# EAGLE design powerBoard_v2 (EAGLE 6.6.0)
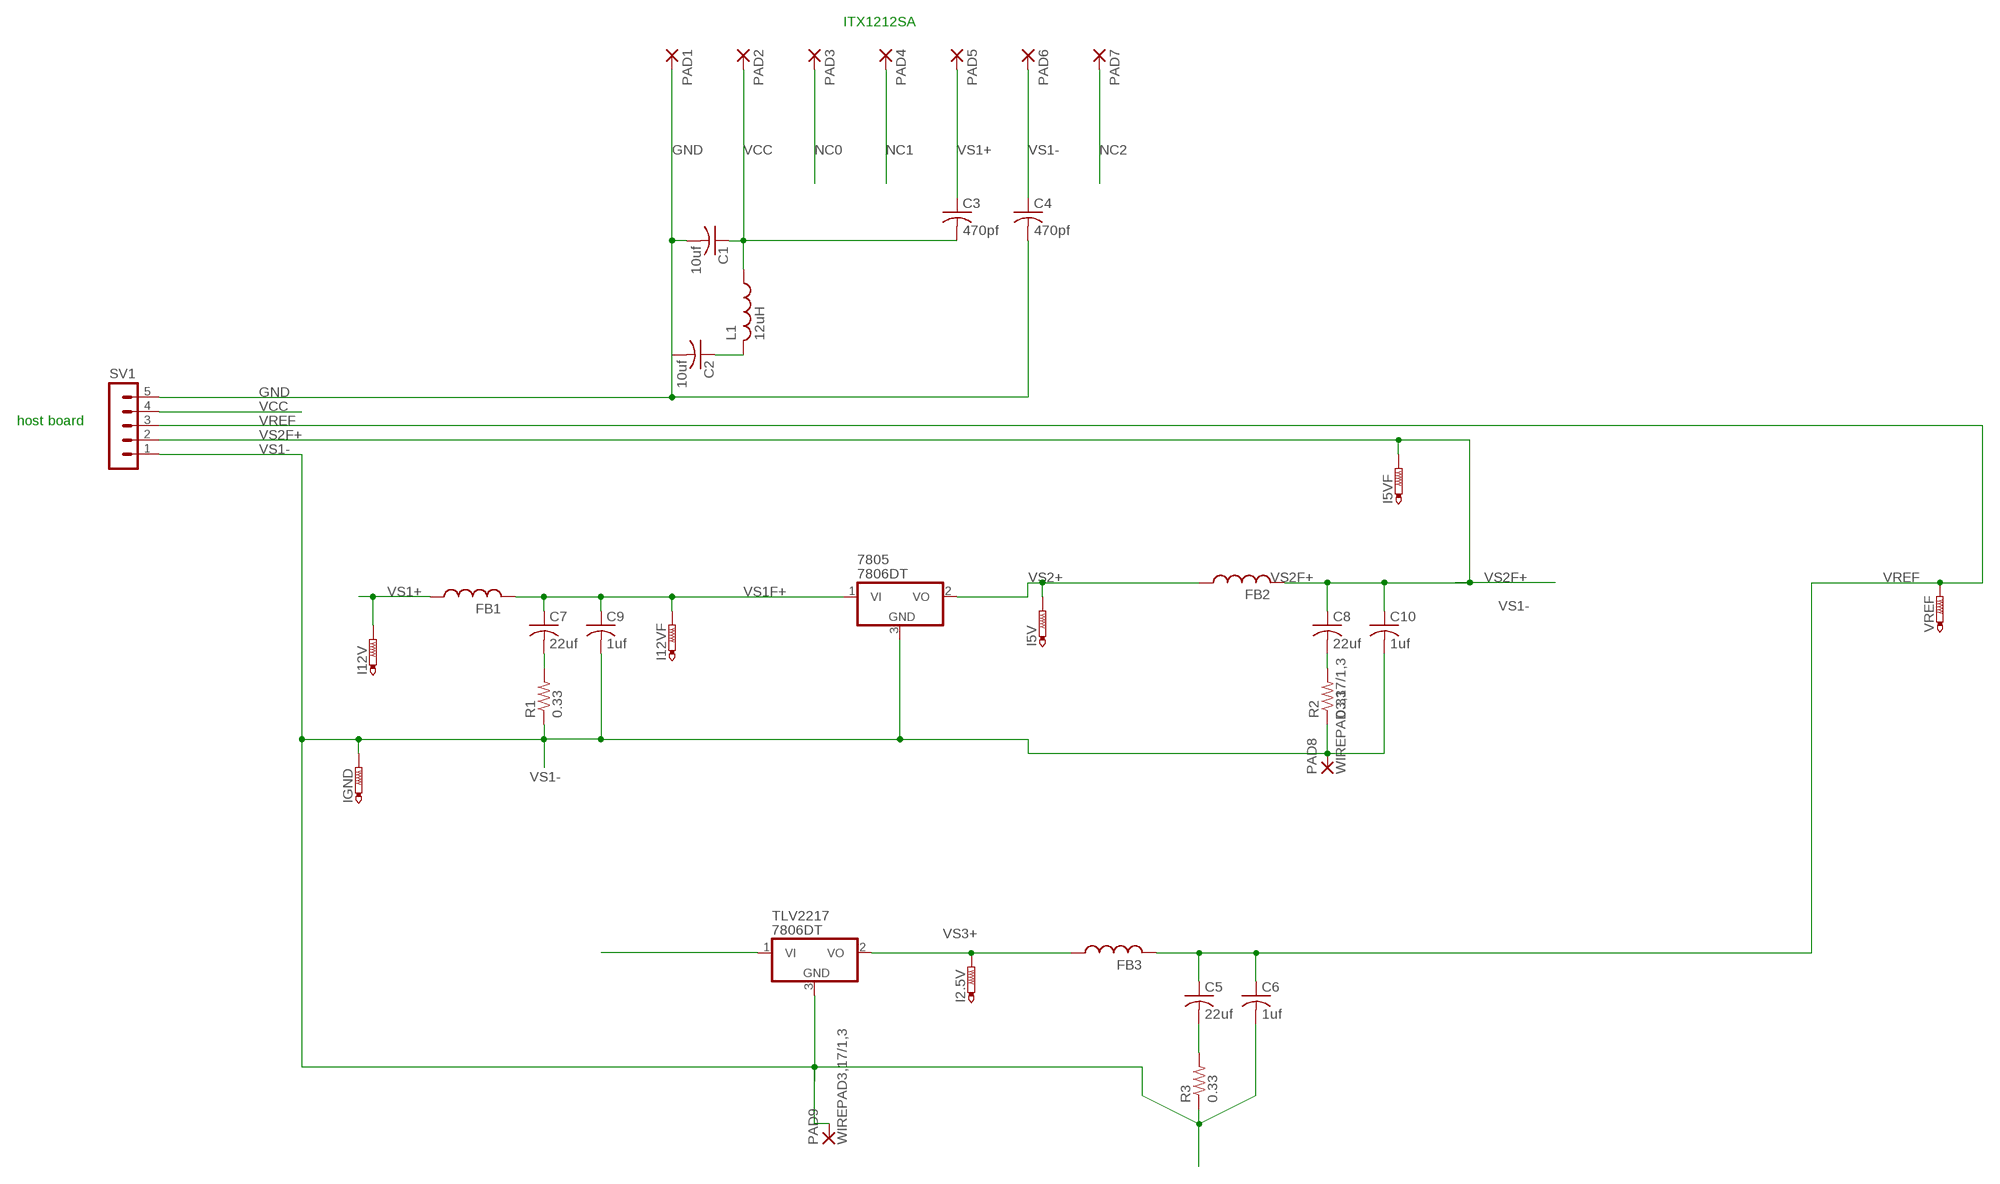
[diagram p0: schematic, sheet 1]

## Parts
7805  7806DT  [TO252]
C1  10uf  C-USC0805K  [C0805K]
C2  10uf  C-USC0805K  [C0805K]
C3  470pf  C-USC0805K  [C0805K]
C4  470pf  C-USC0805K  [C0805K]
C5  22uf  C-USC0805K  [C0805K]
C6  1uf  C-USC0805K  [C0805K]
C7  22uf  C-USC0805K  [C0805K]
C8  22uf  C-USC0805K  [C0805K]
C9  1uf  C-USC0805K  [C0805K]
C10  1uf  C-USC0805K  [C0805K]
FB1  L-USL2012C  [L2012C]
FB2  L-USL2012C  [L2012C]
FB3  L-USL2012C  [L2012C]
I2.5V  PTR1PAD1-13  [P1-13]
I5V  PTR1PAD1-13  [P1-13]
I5VF  PTR1PAD1-13  [P1-13]
I12V  PTR1PAD1-13  [P1-13]
I12VF  PTR1PAD1-13  [P1-13]
IGND  PTR1PAD1-13  [P1-13]
L1  12uH  L-USL2012C  [L2012C]
PAD1  SMD2  [SMD1,27-2,54]
PAD2  SMD2  [SMD1,27-2,54]
PAD3  SMD2  [SMD1,27-2,54]
PAD4  SMD2  [SMD1,27-2,54]
PAD5  SMD2  [SMD1,27-2,54]
PAD6  SMD2  [SMD1,27-2,54]
PAD7  SMD2  [SMD1,27-2,54]
PAD8  WIREPAD3,17/1,3  [3,17/1,3]
PAD9  WIREPAD3,17/1,3  [3,17/1,3]
R1  0.33  R-US_R2012W  [R2012W]
R2  0.33  R-US_R2012W  [R2012W]
R3  0.33  R-US_R2012W  [R2012W]
SV1  MA05-1  [MA05-1]
TLV2217  7806DT  [TO252]
VREF  PTR1PAD1-13  [P1-13]

## Nets
GND: C1.2 C2.2 C4.2 PAD1.1(P) SV1.5
N$1: C2.1 L1.2
N$2: C5.2 R3.2
N$3: C8.2 R2.2
N$4: C7.2 R1.2
NC0: PAD3.1(P)
NC1: PAD4.1(P)
NC2: PAD7.1(P)
VCC: C1.1 C3.2 L1.1 PAD2.1(P) SV1.4
VREF: C5.1 C6.1 FB3.2 SV1.3 VREF.TP
VS1+: C3.1 FB1.1 I12V.TP PAD5.1(P)
VS1-: 7805.3(GND) C4.1 C6.2 C9.2 C10.2 IGND.TP PAD6.1(P) PAD8.1(P) PAD9.1(P) R1.1 R2.1 R3.1 SV1.1 TLV2217.3(GND)
VS1F+: 7805.1(VI) C7.1 C9.1 FB1.2 I12VF.TP TLV2217.1(VI)
VS2+: 7805.2(VO) FB2.1 I5V.TP
VS2F+: C8.1 C10.1 FB2.2 I5VF.TP SV1.2
VS3+: FB3.1 I2.5V.TP TLV2217.2(VO)

## Notes on the sheet
- ITX1212SA
- host board

## Library data of the parts
7805 TLV2217 = linear:78*: Positive VOLTAGE REGULATOR Source: http://cache.national.com/ds/LM/LM78L05.pdf http://www.fairchildsemi.com/ds/LM/LM7805.pdf
C1-C10 = rcl:C-US: CAPACITOR, American symbol
FB1-FB3 = rcl:L-US: INDUCTOR, American symbol
I2.5V I5V I5VF I12V I12VF IGND VREF = testpad:PTR1: TEST PIN
L1 = resistor:L-US: INDUCTOR, American symbol
PAD1-PAD7 = wirepad:SMD2: SMD PAD
PAD8 PAD9 = wirepad:WIREPAD: Wire PAD connect wire on PCB
R1-R3 = resistor:R-US_: RESISTOR, American symbol
SV1 = con-lstb:MA05-1: PIN HEADER; OC_FARNELL: unknown; OC_NEWARK: unknown

## Board
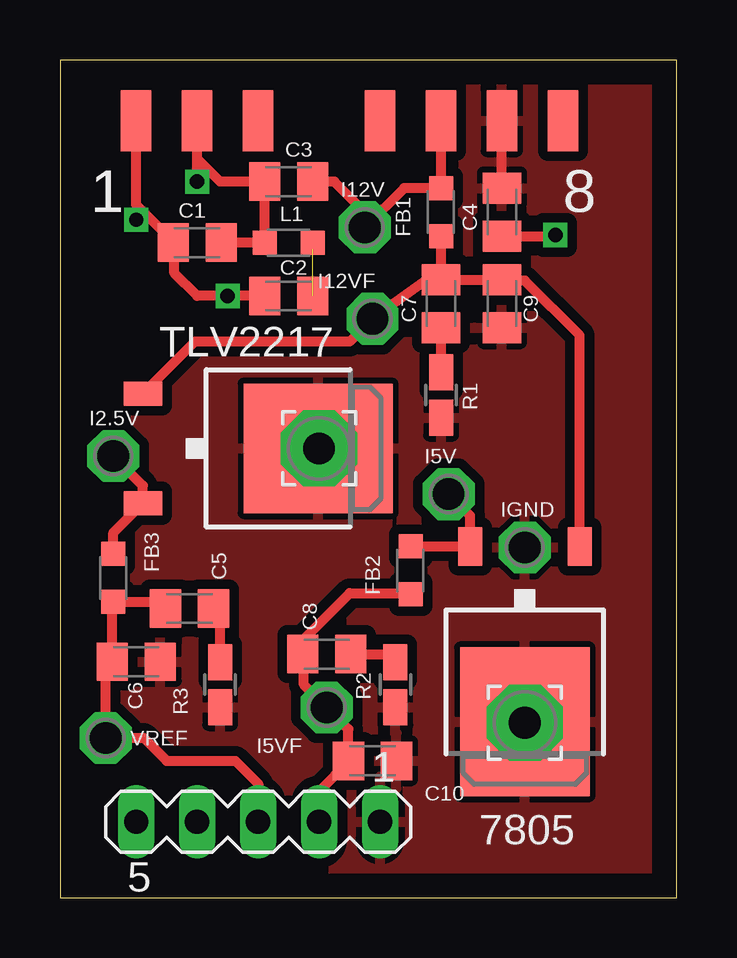
[diagram p1: board, top side]
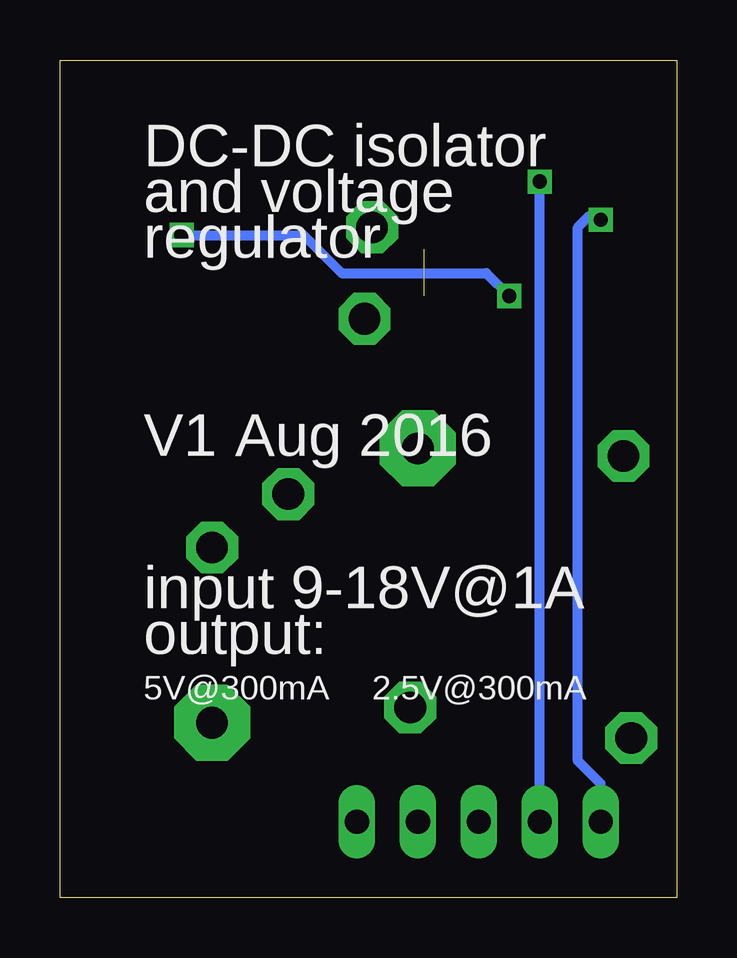
[diagram p2: board, bottom side, seen from below]

Size 25.7 x 34.91 mm. Coordinates in mm from the lower left corner, seen from the top.
Outline: 0,0 25.7,0 25.7,34.91 0,34.91 0,0
Copper layers (1*16): Top 0.035mm / dielectric 1.5mm / Bottom 0.035mm
Design rules "default *": minimum track width 10mil, minimum drill 10mil, track to track 8mil, track to pad 8mil, pad to pad 8mil, via to via 8mil, smd to smd 8mil, copper to edge 40mil, drill to drill 8mil, minimum pad ring 10mil, minimum via ring 8mil, stop-mask expansion 4mil, vias tented up to drill 0mil, thermal gap 10mil

### Footprints (pad centres in the part's own frame; a part is rotated, then mirrored left to right if it is on the bottom)
TO252 = smd 1 x 1.6: 1 -2.28,-4.8; 2 2.28,-4.8 | smd 5.4 x 6.2: 3 0,2.5
C0805K = smd 1.3 x 1.6: 1 -1,0; 2 1,0
L2012C = smd 1 x 1: 1 -1,0; 2 1,0
P1-13 = drill 1.321 pad 2.159 octagon: TP 0,0
SMD1,27-2,54 = smd 1.27 x 2.54: 1 0,0
3,17/1,3 = drill 1.321 pad 3.175 octagon: 1 0,0
R2012W = smd 1.5 x 1: 1 -0.94,0; 2 0.94,0
MA05-1 = drill 1.016 long: 1 -5.08,0; 2 -2.54,0; 3 0,0; 4 2.54,0; 5 5.08,0

### Placement (x,y rotation side)
7805  19.37,9.84 180 top
C1  5.71,27.3 180 top
C2  9.53,25.08 180 top
C3  9.53,29.84 180 top
C4  18.41,28.57 270 top
C5  5.4,12.06 0 top
C6  3.17,9.84 0 top
C7  15.88,24.77 270 top
C8  11.11,10.16 0 top
C9  18.41,24.77 270 top
C10  13.02,5.71 0 top
FB1  15.88,28.57 270 top
FB2  14.61,13.65 270 top
FB3  2.22,13.34 270 top
I2.5V  2.22,18.41 0 top
I5V  16.19,16.83 0 top
I5VF  11.11,7.94 0 top
I12V  12.7,27.94 0 top
I12VF  13.02,24.13 0 top
IGND  19.37,14.61 0 top
L1  9.53,27.3 0 top
PAD1  3.17,32.38 0 top
PAD2  5.71,32.38 0 top
PAD3  8.26,32.38 0 top
PAD4  13.34,32.38 0 top
PAD5  15.88,32.38 0 top
PAD6  18.41,32.38 0 top
PAD7  20.95,32.38 0 top
PAD8  19.37,7.3 0 top
PAD9  10.79,18.73 0 top
R1  15.88,20.95 90 top
R2  13.97,8.89 90 top
R3  6.67,8.89 90 top
SV1  8.26,3.17 180 top
TLV2217  8.26,18.73 270 top
VREF  1.91,6.67 0 top

### Tracks (layer width: path | path; a pad name or v marks a point on that pad's centre or on a via)
GND  (via drill 0.6)
  Top 0.406: 3.49,28.57 4.71,27.35 C1.2 4.76,27.26 4.76,26.04 5.71,25.08 v6.99,25.08 C2.2 | 3.49,28.57 3.17,28.89 PAD1.1 | v3.17,28.26 3.49,28.57 | C4.2 20.59,27.57 v20.64,27.62
  Bottom 0.406: SV1.5 3.17,4.76 4.13,5.71 4.13,27.94 3.65,28.42 3.33,28.42 v3.17,28.26 | v20.64,27.62 15.56,27.62 13.97,26.04 7.94,26.04 v6.99,25.08
N$1  (1 unrouted)
  Top 0.406: L1.2 10.79,27.3 10.53,27.04
N$2
  Top 0.406: R3.2 6.67,11.79 C5.2
N$3
  Top 0.406: C8.2 13.64,10.16 R2.2
N$4
  Top 0.406: R1.2 C7.2
VCC  (via drill 0.6)
  Top 0.406: C1.1 L1.1 C3.2 6.67,29.84 5.71,30.8 PAD2.1 v5.71,29.84
  Bottom 0.406: SV1.4 v5.71,29.84
VREF
  Top 0.406: C5.1 4.13,12.34 FB3.2 2.17,12.29 C6.1 1.91,9.57 VREF.TP 3.49,6.67 4.45,5.71 7.3,5.71 8.26,4.76 SV1.3
VS1+
  Top 0.406: PAD5.1 FB1.1 14.34,29.57 I12V.TP 12.7,28.57 11.43,29.84 C3.1
VS1-
  Top 0.406: C4.1 PAD6.1
  pour Top (isolate 0.406): 0,0 25.72,0 25.72,34.92 0,34.92
VS1F+
  Top 0.406: C7.1 C9.1 18.46,25.72 19.37,25.72 21.65,23.44 7805.1 | C7.1 FB1.2 | C7.1 15.29,25.77 I12VF.TP 12.06,23.18 5.62,23.18 TLV2217.1
VS2+
  Top 0.406: FB2.1 17.08,14.65 7805.2 17.09,15.93 I5V.TP
VS2F+
  Top 0.406: SV1.2 10.79,4.45 12.02,5.67 C10.1 12.02,7.03 I5VF.TP 10.16,8.89 10.16,10.11 C8.1 10.11,10.75 12.06,12.7 14.56,12.7 FB2.2
VS3+
  Top 0.406: FB3.1 2.22,15.22 TLV2217.2 3.46,17.18 I2.5V.TP

### Text on the board
tNames: 1 | 8
bNames: DC-DC isolator | and voltage | regulator | Aug 2016 | V1 | input 9-18V@1A | output: | 2.5V@300mA | 5V@300mA
tValues: 1